# Altium project 003.ccd424.PrjPcb
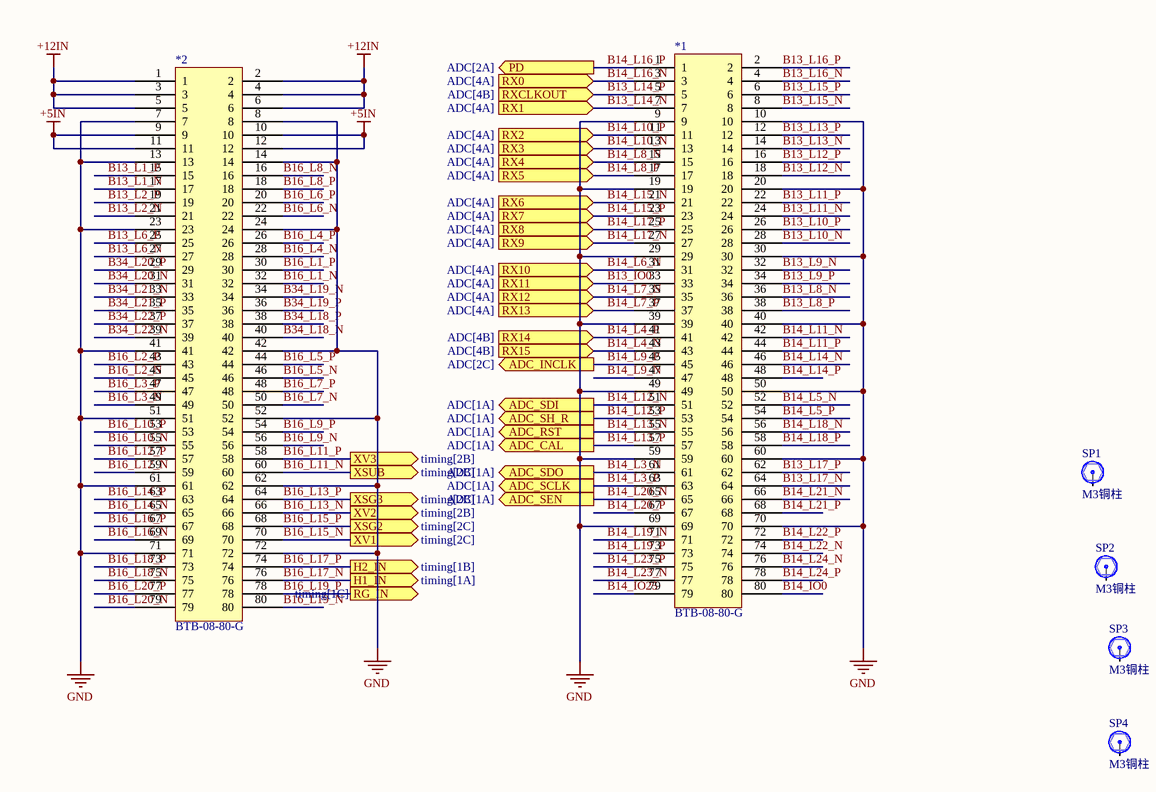
[diagram p0: connect.SchDoc]
4 sheets, 101 parts. Net scope: flat (ports and power ports of the same name join across sheets).
Board file: PCB2.PcbDoc
Sheets:
  connect.SchDoc
  power.SchDoc
  CCD.SchDoc
  timing.SchDoc

## Sheet connect.SchDoc
size A4; SheetNumber: 1; SheetTotal: 5

### Parts
*1  BTB-08-80-G  [BTB-08-80-G]
*2  BTB-08-80-G  [BTB-08-80-G]
SP1  M3铜柱  [M3x5_N]
SP2  M3铜柱  [M3x5_N]
SP3  M3铜柱  [M3x5_N]
SP4  M3铜柱  [M3x5_N]

### Ports
ADC_CAL (out, see ADC[1A]), ADC_INCLK (out, see ADC[2C]), ADC_RST (out, see ADC[1A]), ADC_SCLK (out, see ADC[1A]), ADC_SDI (out, see ADC[1A]), ADC_SDO (out, see ADC[1A]), ADC_SEN (out, see ADC[1A]), ADC_SH_R (out, see ADC[1A]), H1_IN (out, see timing[1A]), H2_IN (out, see timing[1B]), PD (out, see ADC[2A]), RG_IN (out, see timing[1C]), RX0 (in, see ADC[4A]), RX1 (in, see ADC[4A]), RX2 (in, see ADC[4A]), RX3 (in, see ADC[4A]), RX4 (in, see ADC[4A]), RX5 (in, see ADC[4A]), RX6 (in, see ADC[4A]), RX7 (in, see ADC[4A]), RX8 (in, see ADC[4A]), RX9 (in, see ADC[4A]), RX10 (in, see ADC[4A]), RX11 (in, see ADC[4A]), RX12 (in, see ADC[4A]), RX13 (in, see ADC[4A]), RX14 (in, see ADC[4B]), RX15 (in, see ADC[4B]), RXCLKOUT (in, see ADC[4B]), XSG2 (out, see timing[2C]), XSG3 (out, see timing[2B]), XSUB (out, see timing[2B]), XV1 (out, see timing[2C]), XV2 (out, see timing[2B]), XV3 (out, see timing[2B])

### Nets
+5IN: *2.9 *2.10 *2.11 *2.12
+12IN: *2.1 *2.2 *2.3 *2.4 *2.5 *2.6
GND: *1.9 *1.10 *1.19 *1.20 *1.29 *1.30 *1.39 *1.40 *1.49 *1.50 *1.59 *1.60 *1.69 *1.70 *2.7 *2.8 *2.13 *2.14 *2.23 *2.24 *2.41 *2.42 *2.51 *2.52 *2.61 *2.62 *2.71 *2.72
B13_IO0: *1.33 ; port RX11
B13_L1_N: *2.17
B13_L1_P: *2.15
B13_L2_N: *2.21
B13_L2_P: *2.19
B13_L6_N: *2.27
B13_L6_P: *2.25
B13_L8_N: *1.36
B13_L8_P: *1.38
B13_L9_N: *1.32
B13_L9_P: *1.34
B13_L10_N: *1.28
B13_L10_P: *1.26
B13_L11_N: *1.24
B13_L11_P: *1.22
B13_L12_N: *1.18
B13_L12_P: *1.16
B13_L13_N: *1.14
B13_L13_P: *1.12
B13_L14_N: *1.7 ; port RX1
B13_L14_P: *1.5 ; port RXCLKOUT
B13_L15_N: *1.8
B13_L15_P: *1.6
B13_L16_N: *1.4
B13_L16_P: *1.2
B13_L17_N: *1.64
B13_L17_P: *1.62
B14_IO0: *1.80
B14_IO25: *1.79
B14_L3_N: *1.61 ; port ADC_SDO
B14_L3_P: *1.63 ; port ADC_SCLK
B14_L4_N: *1.43 ; port RX15
B14_L4_P: *1.41 ; port RX14
B14_L5_N: *1.52
B14_L5_P: *1.54
B14_L6_N: *1.31 ; port RX10
B14_L7_N: *1.35 ; port RX12
B14_L7_P: *1.37 ; port RX13
B14_L8_N: *1.15 ; port RX4
B14_L8_P: *1.17 ; port RX5
B14_L9_N: *1.47
B14_L9_P: *1.45 ; port ADC_INCLK
B14_L10_N: *1.13 ; port RX3
B14_L10_P: *1.11 ; port RX2
B14_L11_N: *1.42
B14_L11_P: *1.44
B14_L12_N: *1.51 ; port ADC_SDI
B14_L12_P: *1.53 ; port ADC_SH_R
B14_L13_N: *1.55 ; port ADC_RST
B14_L13_P: *1.57 ; port ADC_CAL
B14_L14_N: *1.46
B14_L14_P: *1.48
B14_L15_N: *1.21 ; port RX6
B14_L15_P: *1.23 ; port RX7
B14_L16_N: *1.3 ; port RX0
B14_L16_P: *1.1 ; port PD
B14_L17_N: *1.27 ; port RX9
B14_L17_P: *1.25 ; port RX8
B14_L18_N: *1.56
B14_L18_P: *1.58
B14_L19_N: *1.71
B14_L19_P: *1.73
B14_L20_N: *1.65 ; port ADC_SEN
B14_L20_P: *1.67
B14_L21_N: *1.66
B14_L21_P: *1.68
B14_L22_N: *1.74
B14_L22_P: *1.72
B14_L23_N: *1.77
B14_L23_P: *1.75
B14_L24_N: *1.76
B14_L24_P: *1.78
B16_L1_N: *2.32
B16_L1_P: *2.30
B16_L2_N: *2.45
B16_L2_P: *2.43
B16_L3_N: *2.49
B16_L3_P: *2.47
B16_L4_N: *2.28
B16_L4_P: *2.26
B16_L5_N: *2.46
B16_L5_P: *2.44
B16_L6_N: *2.22
B16_L6_P: *2.20
B16_L7_N: *2.50
B16_L7_P: *2.48
B16_L8_N: *2.16
B16_L8_P: *2.18
B16_L9_N: *2.56
B16_L9_P: *2.54
B16_L10_N: *2.55
B16_L10_P: *2.53
B16_L11_N: *2.60 ; port XSUB
B16_L11_P: *2.58 ; port XV3
B16_L12_N: *2.59
B16_L12_P: *2.57
B16_L13_N: *2.66 ; port XV2
B16_L13_P: *2.64 ; port XSG3
B16_L14_N: *2.65
B16_L14_P: *2.63
B16_L15_N: *2.70 ; port XV1
B16_L15_P: *2.68 ; port XSG2
B16_L16_N: *2.69
B16_L16_P: *2.67
B16_L17_N: *2.76 ; port H1_IN
B16_L17_P: *2.74 ; port H2_IN
B16_L18_N: *2.75
B16_L18_P: *2.73
B16_L19_N: *2.80
B16_L19_P: *2.78 ; port RG_IN
B16_L20_N: *2.79
B16_L20_P: *2.77
B34_L18_N: *2.40
B34_L18_P: *2.38
B34_L19_N: *2.34
B34_L19_P: *2.36
B34_L20_N: *2.31
B34_L20_P: *2.29
B34_L21_N: *2.33
B34_L21_P: *2.35
B34_L22_N: *2.39
B34_L22_P: *2.37

Not connected (* = marked no-connect by the designer): SP1 1; SP2 1; SP3 1; SP4 1

### Library data of the parts
SP1-SP4 = 铜柱大焊盘: 铜柱; 版权归属: 封装库来自淘宝 ID：黄晶宝石; BOM名称: 铜柱; 学习资源: https://shop463601444.taobao.com

## Sheet power.SchDoc
size A4; SheetNumber: 2; SheetTotal: 5
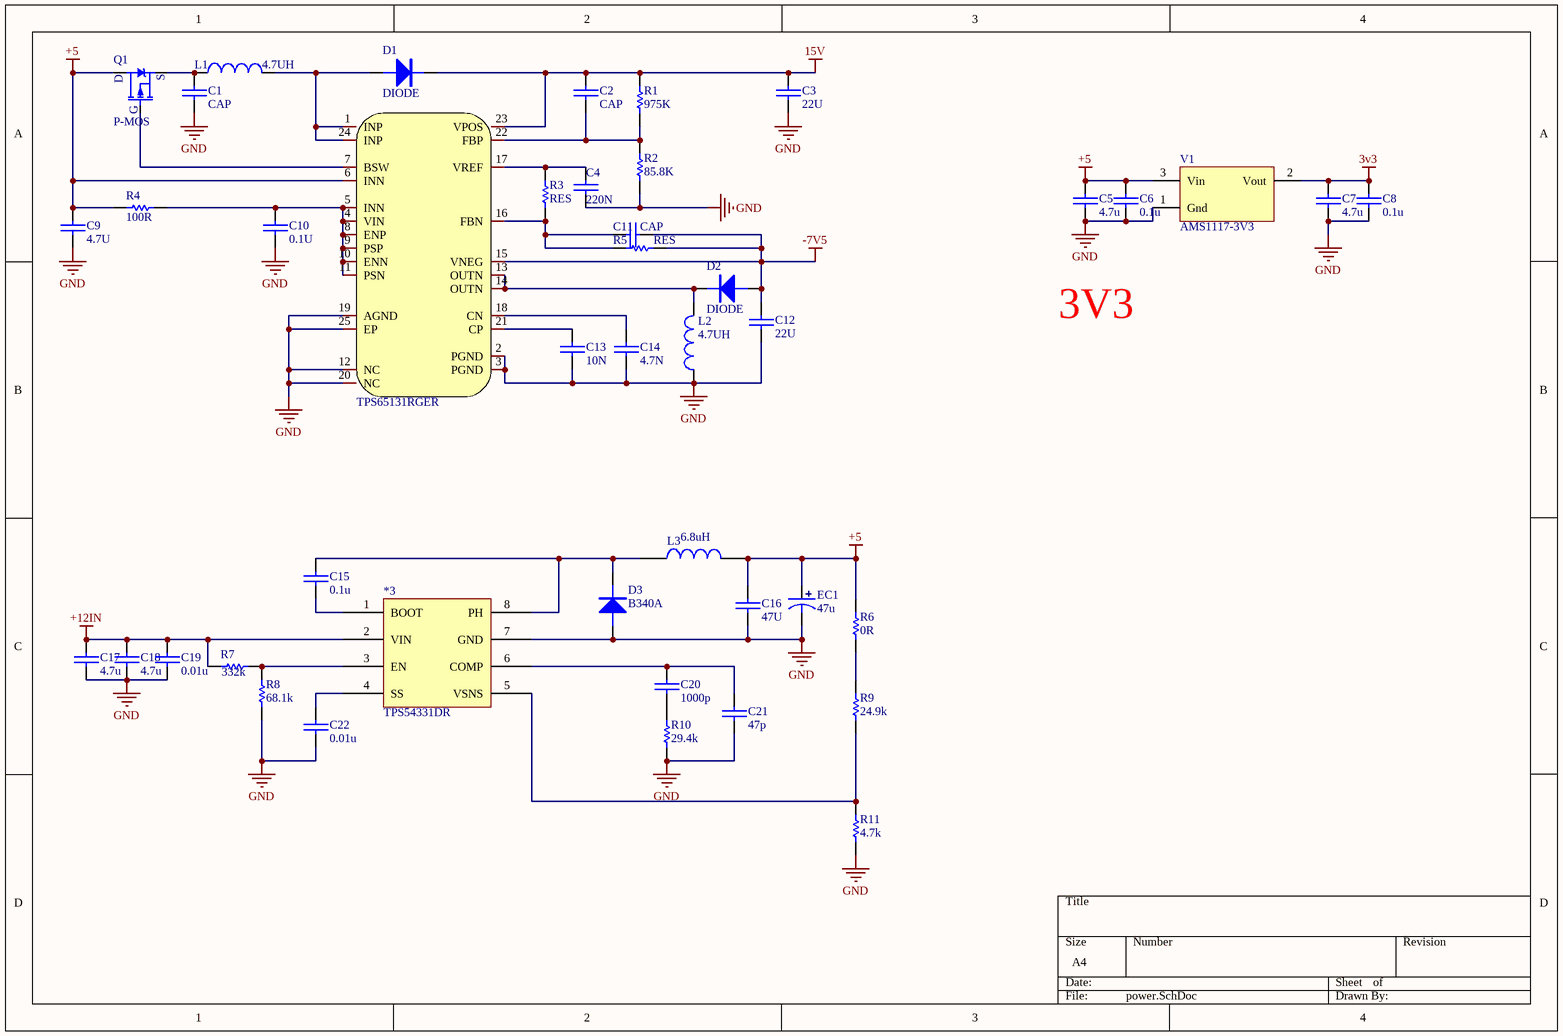
[diagram p1: power.SchDoc]

### Parts
*3  TPS54331DR  [SOIC-8]
C1  CAP  [0603C]
C2  CAP  [0603C]
C3  22U  [0603C]
C4  220N  [0603C]
C5  4.7u  [0603C]
C6  0.1u  [0603C]
C7  4.7u  [0603C]
C8  0.1u  [0603C]
C9  4.7U  [0603C]
C10  0.1U  [0603C]
C11  CAP  [0603C]
C12  22U  [0603C]
C13  10N  [0603C]
C14  4.7N  [0603C]
C15  0.1u  [0603C]
C16  47U  [0603C]
C17  4.7u  [0603C]
C18  4.7u  [0603C]
C19  0.01u  [0603C]
C20  1000p  [0603C]
C21  47p  [0603C]
C22  0.01u  [0603C]
D1  DIODE  [SOD-123]
D2  DIODE  [SOD-123]
D3  B340A  [SMA/DO-214AC]
EC1  47u  [SMD-EC6.3X6.3X10]
L1  4.7UH  [L-SMD-0420]
L2  4.7UH  [L-SMD-0420]
L3  6.8uH  [L-SMD-0630]
Q1  P-MOS  [SOT23]
R1  975K  [0603R]
R2  85.8K  [0603R]
R3  RES  [0603R]
R4  100R  [0603R]
R5  RES  [0603R]
R6  0R  [0603R]
R7  332k  [0603R]
R8  68.1k  [0603R]
R9  24.9k  [0603R]
R10  29.4k  [0603R]
R11  4.7k  [0603R]
U1  TPS65131RGER  [QFN-24_L4.0-W4.0-P0.50-TL-EP2.6]
V1  AMS1117-3V3  [SOT223_L]

### Nets
3v3: C7.2 C8.2 V1.2(Vout)
15V: C2.2 C3.2 D1.K R1.2 U1.23(VPOS)
+5: C5.2 C6.2 C9.2 C16.2 EC1.1 L3.2 Q1.3(D) R4.2 R6.2 U1.6(INN) V1.3(Vin)
+12IN: *3.2(VIN) C17.2 C18.2 C19.2 R7.2
-7V5: C11.1 C12.1 D2.A R5.1 U1.15(VNEG)
GND: *3.7(GND) C1.1 C3.1 C4.1 C5.1 C6.1 C7.1 C8.1 C9.1 C10.1 C12.2 C13.2 C14.2 C16.1 C17.1 C18.1 C19.1 C21.1 C22.1 D3.A EC1.2 L2.1 R2.1 R8.1 R10.1 R11.1 U1.2(PGND) U1.3(PGND) U1.12(NC) U1.19(AGND) U1.20(NC) U1.25(EP) V1.1(Gnd)
Net*3_1: *3.1(BOOT) C15.1
Net*3_3: *3.3(EN) R7.1 R8.2
Net*3_4: *3.4(SS) C22.2
Net*3_5: *3.5(VSNS) R9.1 R11.2
Net*3_6: *3.6(COMP) C20.2 C21.2
Net*3_8: *3.8(PH) C15.2 D3.K L3.1
NetC1_2: C1.2 L1.1 Q1.2(S)
NetC2_1: C2.1 R1.1 R2.2 U1.22(FBP)
NetC4_2: C4.2 R3.2 U1.17(VREF)
NetC10_2: C10.2 R4.1 U1.4(VIN) U1.5(INN) U1.8(ENP) U1.9(PSP) U1.10(ENN) U1.11(PSN)
NetC11_2: C11.2 R3.1 R5.2 U1.16(FBN)
NetC13_1: C13.1 U1.21(CP)
NetC14_1: C14.1 U1.18(CN)
NetC20_1: C20.1 R10.2
NetD1_A: D1.A L1.2 U1.1(INP) U1.24(INP)
NetD2_K: D2.K L2.2 U1.13(OUTN) U1.14(OUTN)
NetQ1_1: Q1.1(G) U1.7(BSW)
NetR6_1: R6.1 R9.2

### Notes on the sheet
- 3V3

### Library data of the parts
*3 = TPS54331DR: 降压型DC-DC
C1-C22 = CAP: 无极性电容
D1-D3 = DIODE: 普通二极管
EC1 = ECAP: 贴片电解电容
L1 L2 = L: 小功率贴片电感
L3 = L: INDUCTOR
Q1 = P-MOS: P沟道场效应管
R1-R11 = RES: 电阻
U1 = TPS65131RGER: 具有正负（双路）输出的 1950mA 升压电流，用于 OLED 和 CCD 传感器; Manufacturer: TI(德州仪器); Add into BOM: yes; Voltage - Output (Min/Fixed): 3.2V, -2V; Voltage - Output (Max): 15V, -15V; Current - Output: 1.8A (Switch); Frequency - Switching: 1.38MHz; Output Type: Adjustable; Number of Outputs: 2; Voltage - Input (Min): 2.7V; Voltage - Input (Max): 5.5V; Topology: Boost, Buck-Boost; Synchronous Rectifier: No; Function: Step-Up, Step-Up/Step-Down; Output Configuration: Positive and Negative (Dual Rail); Name: TPS65131RGER; Symbol: TPS65131RGER; Device: TPS65131RGER; LCSC Part Name: TPS65131RGER; Supplier Part: C87663; Manufacturer Part: TPS65131RGER; Supplier Footprint: QFN-24_4x4x05P; JLCPCB Part Class: Extended Part; Datasheet: https://atta.szlcsc.com/upload/public/pdf/source/20161123/1479873108320.pdf; Supplier: LCSC; Convert to PCB: yes
V1 = AMS1117: LDO; BOM名称: 稳压芯片; 封装库来自淘宝卖家：黄晶宝石: 其他店铺购入的买家，请立即申请退款，本店现金奖励200~1000元

## Sheet CCD.SchDoc
size A4; SheetNumber: 4; SheetTotal: 5
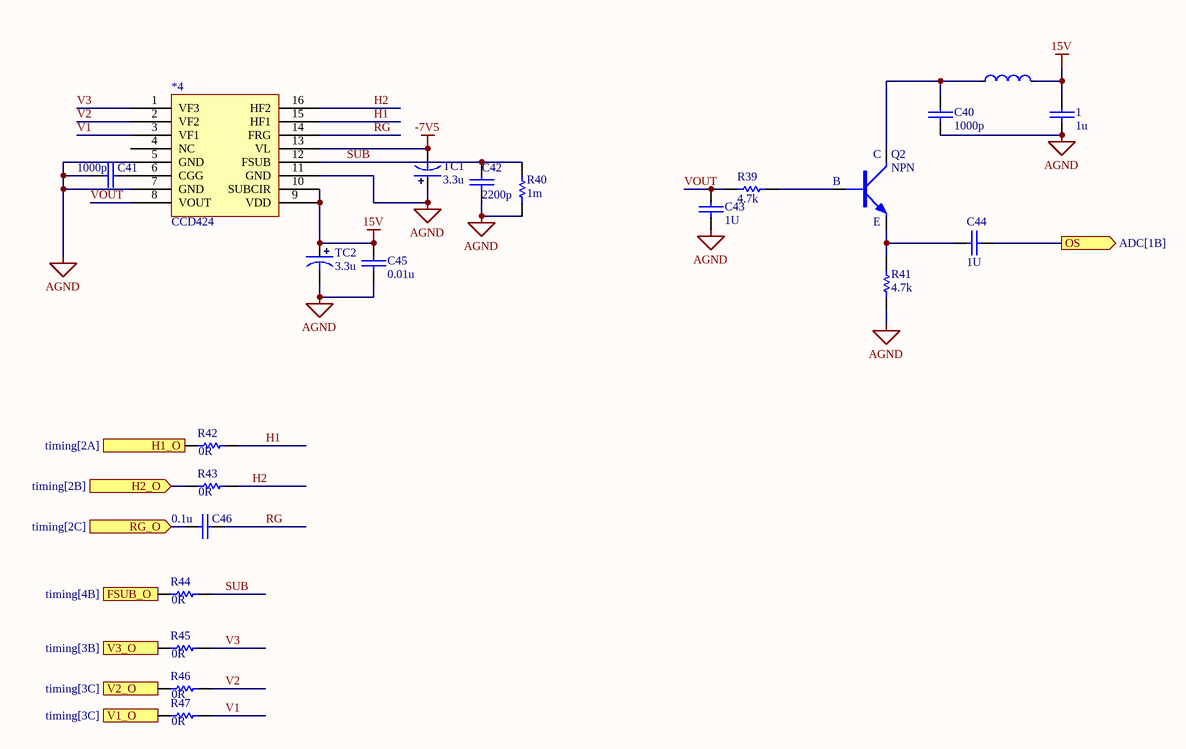
[diagram p2: CCD.SchDoc]

### Parts
1  1u  [0603C]
*4  CCD424  [CCD424]
C40  1000p  [0603C]
C41  1000p  [0603C]
C42  2200p  [0603C]
C43  1U  [0603C]
C44  1U  [0603C]
C45  0.01u  [0603C]
C46  0.1u  [0603C]
L11  GZ1608D601TF  [0603L]  (value not drawn)
Q2  NPN  [SOT23-3]
R39  4.7k  [0603R]
R40  1m  [0603R]
R41  4.7k  [0603R]
R42  0R  [0603R]
R43  0R  [0603R]
R44  0R  [0603R]
R45  0R  [0603R]
R46  0R  [0603R]
R47  0R  [0603R]
TC1  3.3u  [TAJ-A/3216]
TC2  3.3u  [TAJ-A/3216]

### Ports
FSUB_O (in, see timing[4B]), H1_O (in, see timing[2A]), H2_O (in, see timing[2B]), OS (out, see ADC[1B]), RG_O (in, see timing[2C]), V1_O (in, see timing[3C]), V2_O (in, see timing[3C]), V3_O (in, see timing[3B])

### Nets
15V: 1.2 *4.9(VDD) *4.10(SUBCIR) C45.2 L11.2 TC2.1
-7V5: *4.13(VL) TC1.2
AGND: 1.1 *4.5(GND) *4.7(GND) *4.11(GND) C40.1 C41.2 C42.1 C43.2 C45.1 R40.1 R41.1 TC1.1 TC2.2
H1: *4.15(HF1) R42.1
H2: *4.16(HF2) R43.1
RG: *4.14(FRG) C46.1
SUB: *4.12(FSUB) C42.2 R40.2 R44.1
V1: *4.3(VF1) R47.1
V2: *4.2(VF2) R46.1
V3: *4.1(VF3) R45.1
VOUT: *4.8(VOUT) C43.1 R39.2
Net*4_6: *4.6(CGG) C41.1
Net*5_12: R47.2 ; port V1_O
Net*5_14: R46.2 ; port V2_O
Net*5_17: R45.2 ; port V3_O
NetC40_2: C40.2 L11.1 Q2.3(C)
NetC44_1: C44.1 ; port OS
NetC44_2: C44.2 Q2.2(E) R41.2
NetC46_2: C46.2 ; port RG_O
NetC49_1: R44.2 ; port FSUB_O
NetQ2_1: Q2.1(B) R39.1
NetR42_2: R42.2 ; port H1_O
NetR43_2: R43.2 ; port H2_O

Not connected (* = marked no-connect by the designer): *4 4(NC)

### Library data of the parts
1 C40-C46 = CAP: 无极性电容
L11 = FB: 铁氧体磁珠; Manufacturer: Sunlord(顺络); Add into BOM: yes; Impedance @ Frequency: 600Ω@100MHz; Tolerance: ±25%; DC Resistance: 450mΩ; Current Rating: 200mA; Circuits: 1; Name: GZ1608D601TF; Symbol: GZ1608D601TF; Device: GZ1608D601TF; LCSC Part Name: 600Ω@100MHz ±25%; Supplier Part: C1002; Manufacturer Part: GZ1608D601TF; Supplier Footprint: 0603; JLCPCB Part Class: Basic Part; Datasheet: https://atta.szlcsc.com/upload/public/pdf/source/20210830/355EA7C0FAC5394FC0FE3F17C770C20A.pdf; Supplier: LCSC; Convert to PCB: yes
Q2 = NPN: NPN三极管
R39-R47 = RES: 电阻
TC1 TC2 = TCAP: 钽电容

## Sheet timing.SchDoc
size A4; SheetNumber: 5; SheetTotal: 5
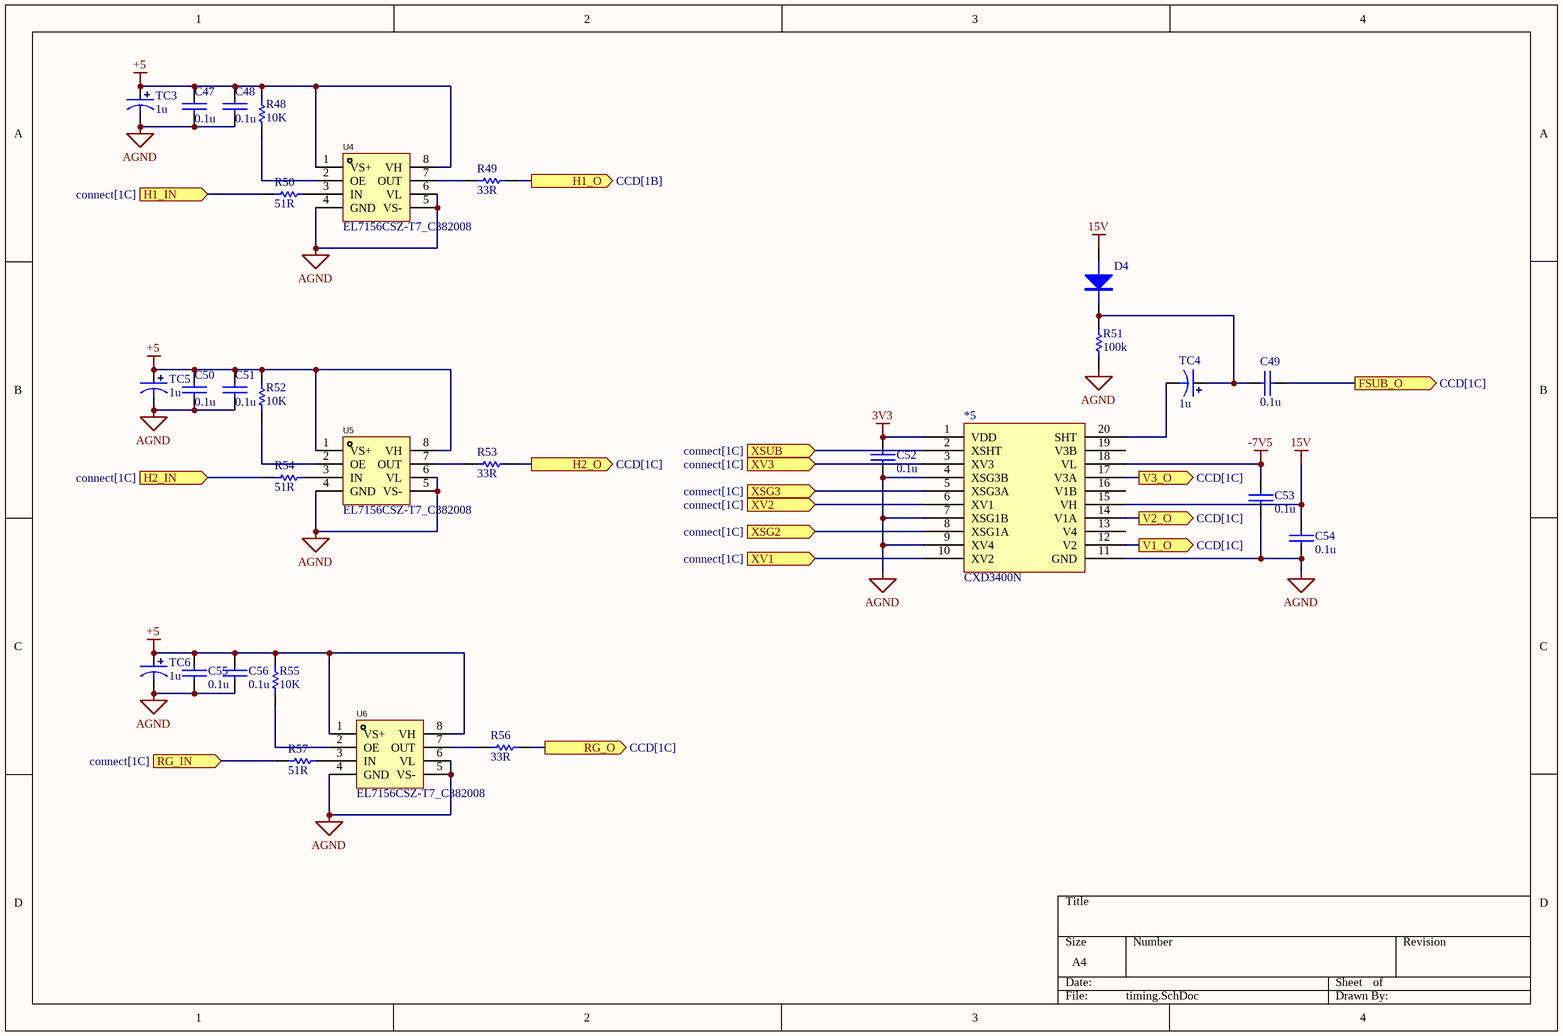
[diagram p3: timing.SchDoc]

### Parts
*5  CXD3400N  [CXD3400N]
C47  0.1u  [0603C]
C48  0.1u  [0603C]
C49  0.1u  [0603C]
C50  0.1u  [0603C]
C51  0.1u  [0603C]
C52  0.1u  [0603C]
C53  0.1u  [0603C]
C54  0.1u  [0603C]
C55  0.1u  [0603C]
C56  0.1u  [0603C]
D4  DIODE  [SOD-123]  (value not drawn)
R48  10K  [0603R]
R49  33R  [0603R]
R50  51R  [0603R]
R51  100k  [0603R]
R52  10K  [0603R]
R53  33R  [0603R]
R54  51R  [0603R]
R55  10K  [0603R]
R56  33R  [0603R]
R57  51R  [0603R]
TC3  1u  [TAJ-A/3216]
TC4  1u  [TAJ-A/3216]
TC5  1u  [TAJ-A/3216]
TC6  1u  [TAJ-A/3216]
U4  EL7156CSZ-T7_C382008  [SOIC-8]
U5  EL7156CSZ-T7_C382008  [SOIC-8]
U6  EL7156CSZ-T7_C382008  [SOIC-8]

### Ports
FSUB_O (out, see CCD[1C]), H1_IN (in, see connect[1C]), H1_O (out, see CCD[1B]), H2_IN (in, see connect[1C]), H2_O (out, see CCD[1C]), RG_IN (in, see connect[1C]), RG_O (out, see CCD[1C]), V1_O (out, see CCD[1C]), V2_O (out, see CCD[1C]), V3_O (out, see CCD[1C]), XSG2 (in, see connect[1C]), XSG3 (in, see connect[1C]), XSUB (in, see connect[1C]), XV1 (in, see connect[1C]), XV2 (in, see connect[1C]), XV3 (in, see connect[1C])

### Nets
3v3: *5.1(VDD) C52.2
15V: *5.15(VH) C54.2 D4.A
+5: C47.1 C48.1 C50.1 C51.1 C55.1 C56.1 R48.1 R52.1 R55.1 TC3.1 TC5.1 TC6.1 U4.1(VS+) U4.8(VH) U5.1(VS+) U5.8(VH) U6.1(VS+) U6.8(VH)
-7V5: *5.18(VL) C53.2
AGND: *5.4(XSG3B) *5.7(XSG1B) *5.9(XV4) *5.11(GND) C47.2 C48.2 C50.2 C51.2 C52.1 C53.1 C54.1 C55.2 C56.2 R51.1 TC3.2 TC5.2 TC6.2 U4.4(GND) U4.5(VS-) U4.6(VL) U5.4(GND) U5.5(VS-) U5.6(VL) U6.4(GND) U6.5(VS-) U6.6(VL)
B16_L11_N: *5.2(XSHT) ; port XSUB
B16_L11_P: *5.3(XV3) ; port XV3
B16_L13_N: *5.6(XV1) ; port XV2
B16_L13_P: *5.5(XSG3A) ; port XSG3
B16_L15_N: *5.10(XV2) ; port XV1
B16_L15_P: *5.8(XSG1A) ; port XSG2
B16_L17_N: R50.2 ; port H1_IN
B16_L17_P: R54.2 ; port H2_IN
B16_L19_P: R57.2 ; port RG_IN
Net*5_12: *5.12(V2) ; port V1_O
Net*5_14: *5.14(V1A) ; port V2_O
Net*5_17: *5.17(V3A) ; port V3_O
Net*5_20: *5.20(SHT) TC4.2
NetC46_2: R56.1 ; port RG_O
NetC49_1: C49.1 ; port FSUB_O
NetC49_2: C49.2 D4.K R51.2 TC4.1
NetR42_2: R49.1 ; port H1_O
NetR43_2: R53.1 ; port H2_O
NetR48_2: R48.2 U4.2(OE)
NetR49_2: R49.2 U4.7(OUT)
NetR50_1: R50.1 U4.3(IN)
NetR52_2: R52.2 U5.2(OE)
NetR53_2: R53.2 U5.7(OUT)
NetR54_1: R54.1 U5.3(IN)
NetR55_2: R55.2 U6.2(OE)
NetR56_2: R56.2 U6.7(OUT)
NetR57_1: R57.1 U6.3(IN)

Not connected (* = marked no-connect by the designer): *5 13(V4) 16(V1B) 19(V3B)

### Library data of the parts
*5 = CXD3400N: 6通道垂直时钟驱动器
C47-C56 = CAP: 无极性电容
D4 = DIODE: 普通二极管
R48-R57 = RES: 电阻
TC3-TC6 = TCAP: 钽电容
U4-U6 = EL7156CSZ-T7: 栅极驱动器; Manufacturer: Intersil(英特矽尔); Add into BOM: yes; Name: EL7156CSZ-T7; Symbol: EL7156CSZ-T7; Device: EL7156CSZ-T7_C382008; LCSC Part Name: EL7156CSZ-T7; Supplier Part: C382008; Manufacturer Part: EL7156CSZ-T7; Supplier Footprint: SOIC-8; JLCPCB Part Class: Extended Part; Datasheet: https://atta.szlcsc.com/upload/public/pdf/source/20190409/C382008_2839965C4C72C039364B6D8C7260FFBC.pdf; Supplier: LCSC; Convert to PCB: yes

## Nets that join several sheets
3v3: power (C7.2 C8.2 V1.2), timing (*5.1 C52.2)
15V: power (5 pins), CCD (6 pins), timing (*5.15 C54.2 D4.A)
+5: power (11 pins), timing (18 pins)
+12IN: connect (6 pins), power (5 pins)
-7V5: power (5 pins), CCD (*4.13 TC1.2), timing (*5.18 C53.2)
AGND: CCD (13 pins), timing (26 pins)
GND: connect (28 pins), power (33 pins)
B16_L11_N: connect (*2.60), timing (*5.2)
B16_L11_P: connect (*2.58), timing (*5.3)
B16_L13_N: connect (*2.66), timing (*5.6)
B16_L13_P: connect (*2.64), timing (*5.5)
B16_L15_N: connect (*2.70), timing (*5.10)
B16_L15_P: connect (*2.68), timing (*5.8)
B16_L17_N: connect (*2.76), timing (R50.2)
B16_L17_P: connect (*2.74), timing (R54.2)
B16_L19_P: connect (*2.78), timing (R57.2)
Net*5_12: CCD (R47.2), timing (*5.12)
Net*5_14: CCD (R46.2), timing (*5.14)
Net*5_17: CCD (R45.2), timing (*5.17)
NetC46_2: CCD (C46.2), timing (R56.1)
NetC49_1: CCD (R44.2), timing (C49.1)
NetR42_2: CCD (R42.2), timing (R49.1)
NetR43_2: CCD (R43.2), timing (R53.1)